# Altium schematic sheet main.SchDoc: Game Console
size A3; Author: Melanie Rojas; Engineer: Melanie Rojas; Organization: PUC; Address1: Santiago, Chile; Address2: -; Address3: -; Address4: -; DocumentNumber: 1000; Revision: 1; SheetNumber: 1; SheetTotal: 1
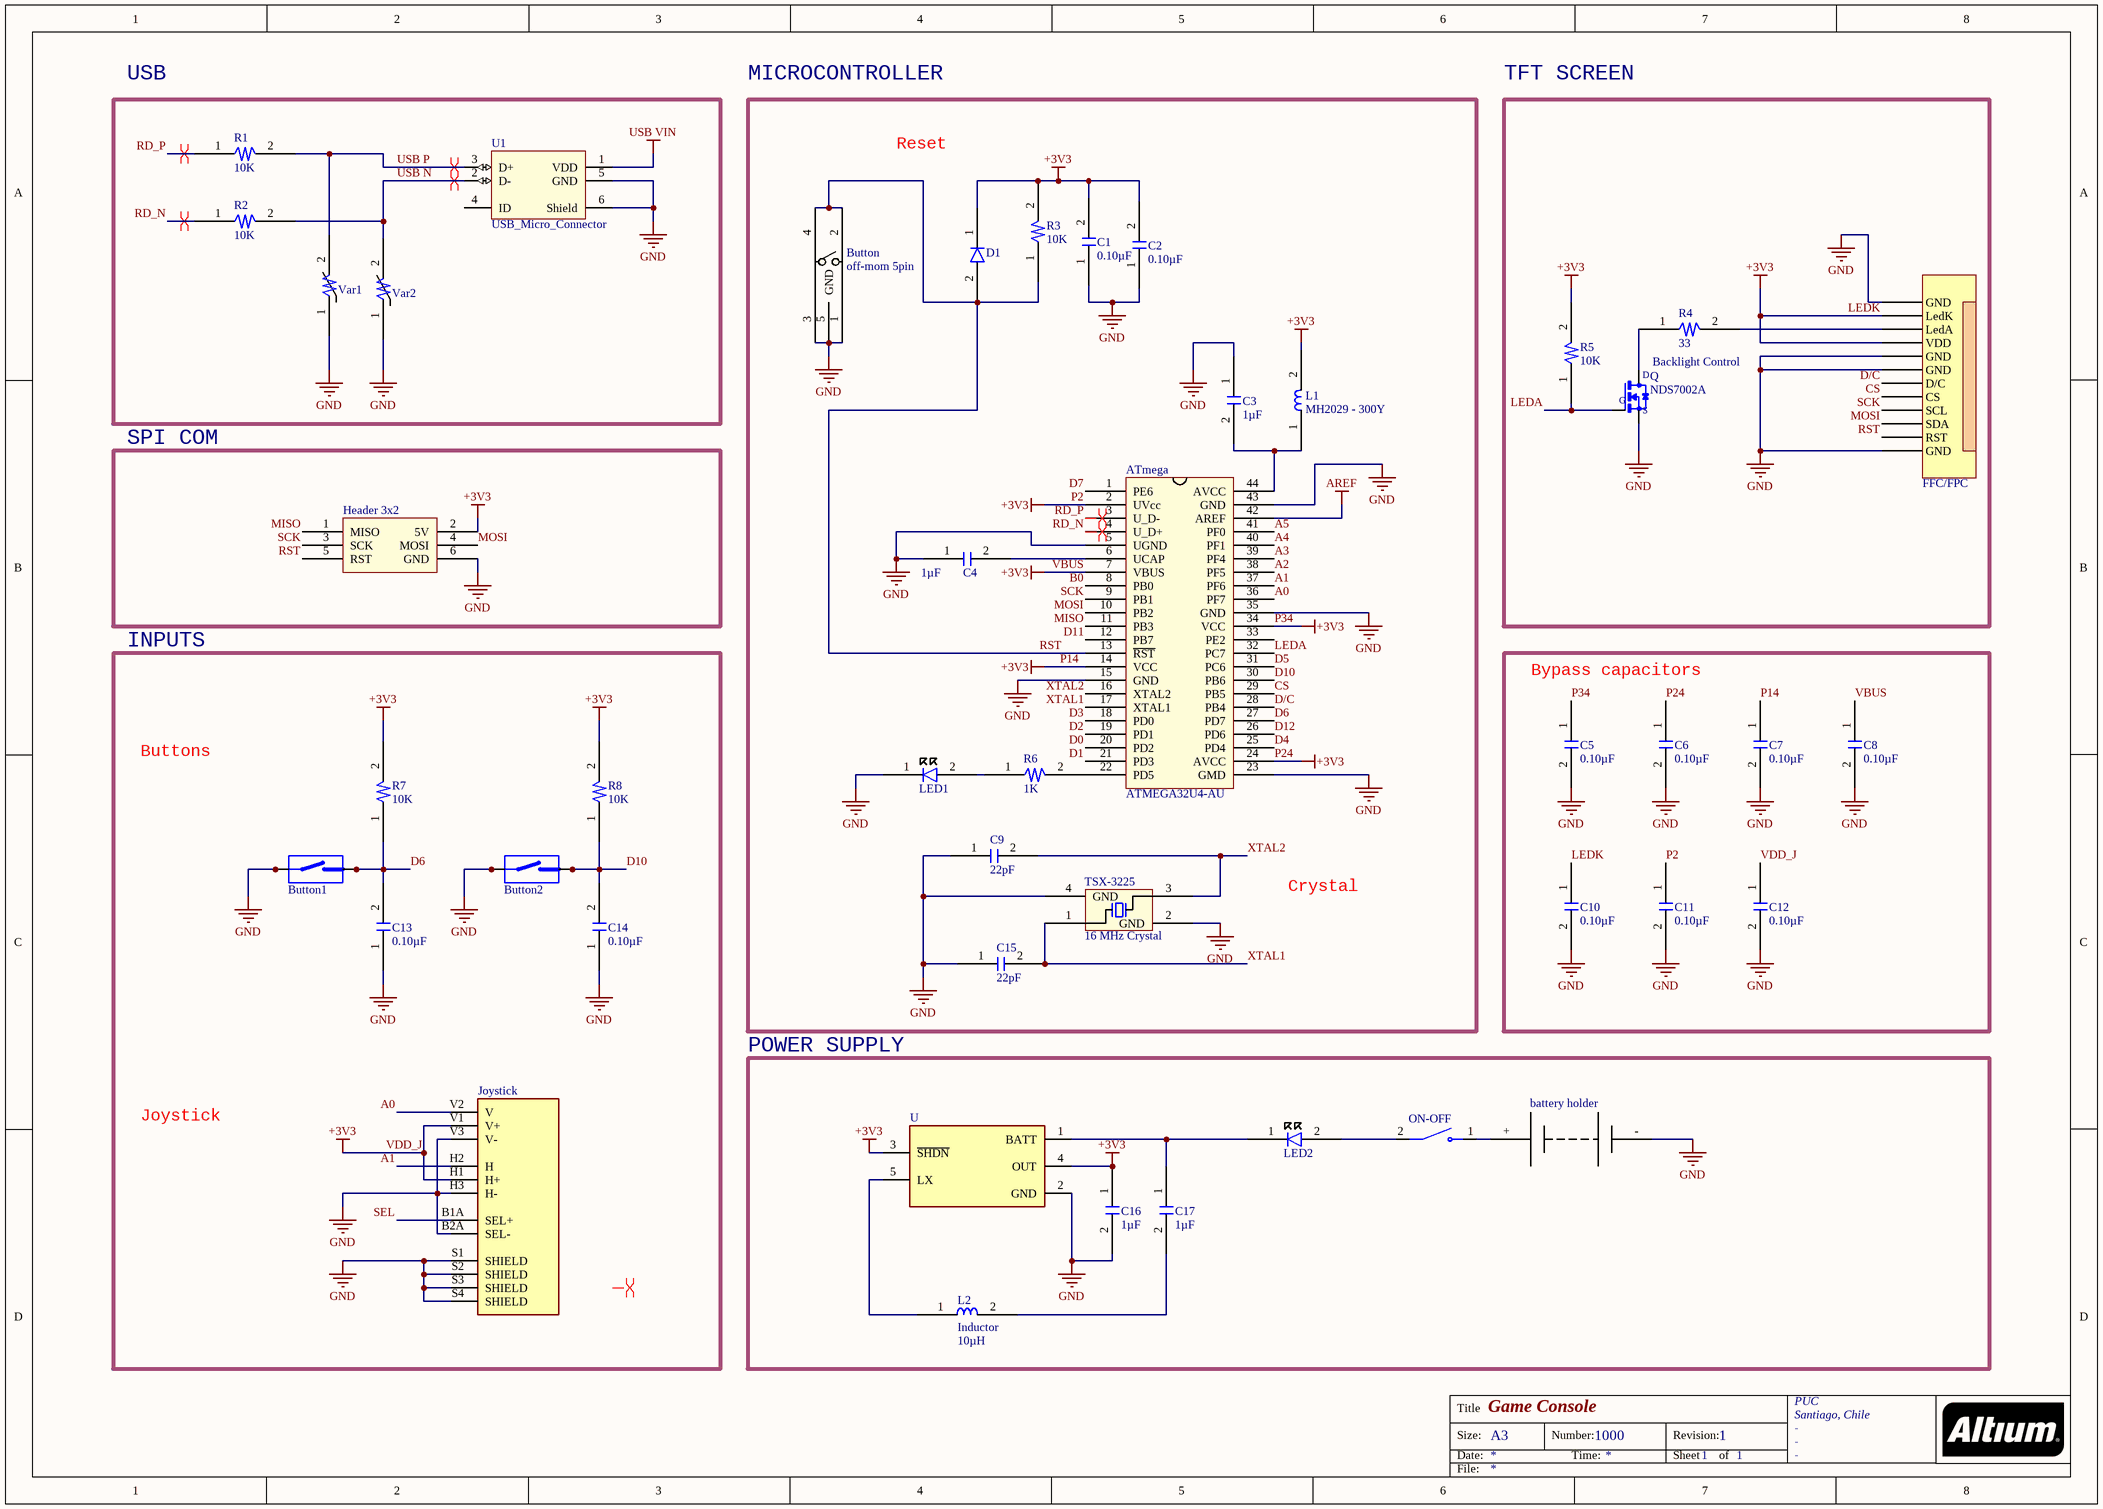
[diagram p0: main.SchDoc]

## Parts
ATmega  Supplier Part Number 1: ATMEGA32U4-AU  [ATmega32u4_TQFP44]  (hidden comment: ATmega32u4)
battery_holder  battery holder  (value not drawn)
Button  off-mom 5pin  [450-1760]
Button1  5-1437565-0  [SW_5-1437565-0]  (value not drawn)
Button2  5-1437565-0  [SW_5-1437565-0]  (value not drawn)
C1  value 0.10µF  [R15_0805_cap_M]  (hidden comment: 0.10µ 25V)
C2  value 0.10µF  [R15_0805_cap_M]  (hidden comment: 0.10µ 25V)
C3  value 1µF  [C2012_M]  (hidden comment: 1µF 50V cap)
C4  value 1µF  [C2012_M]  (hidden comment: 1µF 50V cap)
C5  value 0.10µF  [R15_0805_cap_M]  (hidden comment: 0.10µ 25V)
C6  value 0.10µF  [R15_0805_cap_M]  (hidden comment: 0.10µ 25V)
C7  value 0.10µF  [R15_0805_cap_M]  (hidden comment: 0.10µ 25V)
C8  value 0.10µF  [R15_0805_cap_M]  (hidden comment: 0.10µ 25V)
C9  value 22pF  [R15_0805_cap_M]  (hidden comment: 22pF 50V cap)
C10  value 0.10µF  [R15_0805_cap_M]  (hidden comment: 0.10µ 25V)
C11  value 0.10µF  [R15_0805_cap_M]  (hidden comment: 0.10µ 25V)
C12  value 0.10µF  [R15_0805_cap_M]  (hidden comment: 0.10µ 25V)
C13  value 0.10µF  [R15_0805_cap_M]  (hidden comment: 0.10µ 25V)
C14  value 0.10µF  [R15_0805_cap_M]  (hidden comment: 0.10µ 25V)
C15  value 22pF  [R15_0805_cap_M]  (hidden comment: 22pF 50V cap)
C16  value 1µF  [C2012_M]  (hidden comment: 1µF 50V cap)
C17  value 1µF  [C2012_M]  (hidden comment: 1µF 50V cap)
D1  100V Switching Diode  [C2012_M]  (value not drawn)
FFC/FPC  1-84952-2  (value not drawn)
Header_3x2  J3*2  [J3*2]  (value not drawn)
Joystick  COM-09032  [XDCR_COM-09032]  (value not drawn)
L1  MH2029 - 300Y  [MH2029-300YC]
L2  Inductor  value 10µH  [MH2029-300YC]
LED1  LED  [Wurth led 0805]  (value not drawn)
LED2  LED  [Wurth led 0805]  (value not drawn)
ON-OFF  RB141C1100  [SW_RB141C1100]  (value not drawn)
Q  NDS7002A  [SOT23]
R1  value 10K  [RNCP0805_M]  (hidden comment: Res)
R2  value 10K  [RNCP0805_M]  (hidden comment: Res)
R3  value 10K  [RNCP0805_M]  (hidden comment: Res)
R4  value 33  [RNCP0805_M]  (hidden comment: Res)
R5  value 10K  [RNCP0805_M]  (hidden comment: Res)
R6  value 1K  [RNCP0805_M]  (hidden comment: Res)
R7  value 10K  [RNCP0805_M]  (hidden comment: Res)
R8  value 10K  [RNCP0805_M]  (hidden comment: Res)
TSX-3225  16 MHz Crystal  [TSX-3225]
U  MAX1724EZK33+T  [SOT95P275X110-5N]  (value not drawn)
U1  USB_Micro_Connector  [USB_micro_through]
Var1  Gard Resistor  [UltraGuard 0805]  (value not drawn)
Var2  Gard Resistor  [UltraGuard 0805]  (value not drawn)

## Blocks framed on the sheet
USB: R1 R2 U1 Var1 Var2
MICROCONTROLLER: ATmega Button C1-C4 C9 C15 D1 L1 LED1 R3 R6 TSX-3225
TFT SCREEN: FFC/FPC Q R4 R5
SPI COM: Header_3x2
INPUTS: Button1 Button2 C13 C14 Joystick R7 R8
Bypass capacitors: C5-C8 C10-C12
POWER SUPPLY: battery_holder C16 C17 L2 LED2 ON-OFF U

## Nets
AREF: ATmega.42(AREF)
GND: ATmega.5(UGND) ATmega.15(GND) ATmega.23(GMD) ATmega.35(GND) ATmega.43(GND) Button.1 Button.3 Button.5(GND) Button1.3 Button1.4 Button2.3 Button2.4 C1.1 C2.1 C3.1 C4.1 C5.2 C6.2 C7.2 C8.2 C9.1 C10.2 C11.2 C12.2 C13.1 C14.1 C15.1 C16.2 FFC/FPC.1(GND) FFC/FPC.5(GND) FFC/FPC.6(GND) FFC/FPC.12(GND) Header_3x2.6(GND) Joystick.B2A(SEL-) Joystick.H3(H-) Joystick.S1(SHIELD) Joystick.S2(SHIELD) Joystick.S3(SHIELD) Joystick.S4(SHIELD) Joystick.V3(V-) LED1.1 Q.2(S) TSX-3225.2(GND) TSX-3225.4(GND) U.2(GND) U1.5(GND) U1.6(Shield) Var1.1 Var2.1
LEDK: ATmega.2(UVcc) ATmega.7(VBUS) ATmega.14(VCC) ATmega.24(AVCC) ATmega.34(VCC) C1.2 C2.2 C5.1 C6.1 C7.1 C8.1 C10.1 C11.1 C12.1 C16.1 D1.1 FFC/FPC.2(LedK) FFC/FPC.10(VDD) Header_3x2.2(5V) Joystick.H1(H+) Joystick.V1(V+) L1.2 R3.2 R5.2 R7.2 R8.2 U.3(~{SHDN}) U.4(OUT)  [also labelled +3V3, P14, P2, P24, P34, VBUS, VDD_J]
USB VIN: U1.1(VDD)
A0: ATmega.36(PF7) Joystick.V2(V)
A1: ATmega.37(PF6) Joystick.H2(H)
A2: ATmega.38(PF5)
A3: ATmega.39(PF4)
A4: ATmega.40(PF1)
A5: ATmega.41(PF0)
B0: ATmega.8(PB0)
CS: ATmega.29(PB5) FFC/FPC.8(CS)
D0: ATmega.20(PD2)
D1: ATmega.21(PD3)
D2: ATmega.19(PD1)
D3: ATmega.18(PD0)
D4: ATmega.25(PD4)
D5: ATmega.31(PC6)
D6: ATmega.27(PD7) Button1.1 Button1.2 C13.2 R7.1
D7: ATmega.1(PE6)
D10: ATmega.30(PB6) Button2.1 Button2.2 C14.2 R8.1
D11: ATmega.12(PB7)
D12: ATmega.26(PD6)
D/C: ATmega.28(PB4) FFC/FPC.7(D/C)
LEDA: ATmega.32(PC7) Q.1(G) R5.1
MISO: ATmega.11(PB3) Header_3x2.1(MISO)
MOSI: ATmega.10(PB2) FFC/FPC.10(SDA) Header_3x2.4(MOSI)
RD_N: ATmega.4(U_D+) R2.1
RD_P: ATmega.3(U_D-) R1.1
RST: ATmega.13(~{RST}) Button.2 Button.4 D1.2 FFC/FPC.11(RST) Header_3x2.5(RST) R3.1
SCK: ATmega.9(PB1) FFC/FPC.9(SCL) Header_3x2.3(SCK)
SEL: Joystick.B1A(SEL+)
USB N: R2.2 U1.2(D-) Var2.2
USB P: R1.2 U1.3(D+) Var1.2
XTAL1: ATmega.17(XTAL1) C15.2 TSX-3225.1
XTAL2: ATmega.16(XTAL2) C9.2 TSX-3225.3
NetATmega_6: ATmega.6(UCAP) C4.2
NetATmega_22: ATmega.22(PD5) R6.2
NetATmega_44: ATmega.44(AVCC) C3.2 L1.1
NetC17_1: C17.1 LED2.1 U.1(BATT)
NetC17_2: C17.2 L2.2
NetFFC/FPC_3: FFC/FPC.3(LedA) R4.2
NetL2_1: L2.1 U.5(LX)
NetLED1_2: LED1.2 R6.1
NetLED2_2: LED2.2 ON-OFF.2
NetQ_3: Q.3(D) R4.1

Not connected (* = marked no-connect by the designer): ATmega 33(PE2); battery_holder + -; ON-OFF 1; U1 4(ID)

## Layout directives
differential pair: (no net found under the mark), RD_N, RD_P, USB N, USB P

## Notes on the sheet
- Reset
- Backlight Control
- Buttons
- Crystal
- Joystick
- Title
- Size:
- Date:
- A3
- Number:
- Time:
- Revision:
- Sheet
- of
- File:

## Library data of the parts
battery_holder = BCAAPC: Supplier 1: Digi-Key; Type: Battery holder; Supplier Part Number 1: BCAAPC-ND
Button = Button: Supplier 1: Digi-Key; Supplier Part Number 1: 450-1760-1-ND; Type: Button
Button1 Button2 = 5-1437565-0: Switch Push Button N.O. SPST Round Button 0.05A 12VDC 1VA Alternate Contact Gull Wing SMD T/R; MP: FSM6JSMATR; MF: TE Connectivity; SnapEDA_Link: https://www.snapeda.com/parts/FSM6JSMATR/TE%20Connectivity%20ALCOSWITCH%20Switches/view-part/518064/?ref=snap; Price: None; TE_purchase_URL: https://www.te.com/usa-en/product-5-1437565-0.html?te_bu=Cor&te_type=disp&te_campaign=seda_glo_cor-seda-global-disp-prtnr-fy19-seda-model-bom-cta_sma-317_1&elqCampaignId=32493; Value: *; Availability: Unavailable; Package: None; Supplier 1: Digi-Key; Supplier Part Number 1: 450-2058-1-ND; Type: Button
C1 C2 C5-C8 C10-C14 = 0.10µF 25V Cap: Details: 0.10µF ±10% 25V Ceramic Capacitor X7R 0805 (2012 Metric); Type: Ceramic Capacitor; Footprint: 0805 (2012 Metric) -X7R; Supplier 1: Digi-Key; Supplier Part Number 1: 399-1168-1-ND
C3 C4 C16 C17 = 1µF 50V cap: Type: Capacitor (ceramic); Supplier 1: Digi-Key; Supplier Part Number 1: 445-8890-1-ND
C9 C15 = 22pF 50V cap: Type: Capacitor (ceramic); Supplier 1: Digi-Key; Supplier Part Number 1: 490-5868-1-ND
D1 = CD1206 - S01575: Standard Diode; Supplier 1: Digi-Key; Supplier 2: Arrow; Supplier Part Number 2: CD1206-S01575; Supplier Part Number 1: CD0603-S01575CT-ND
Header_3x2 = J3*2: Header 3*2; Supplier 1: Digi-Key; Supplier Part Number 1: 609-3234-ND
Joystick = COM-09032: Joystick, 2 - Axis Analog _Resistive_ Output; MF: SparkFun Electronics; SnapEDA_Link: https://www.snapeda.com/parts/COM-09032/SparkFun%20Electronics/view-part/888157/?ref=snap; Availability: Unavailable; Value: *; Price: None; MP: COM-09032; Package: SparkFun Electronics; Supplier 1: Digi-Key; Supplier Part Number 1: 1568-1526-ND
L1 = MH2029 - 300Y: Ferrite bead; Value: 30@10MHz; Supplier 1: Digi-Key; Supplier Part Number 1: MH2029-300YCT-ND; Type: Ferrite
LED1 LED2 = LED: LED 0805; Color: RED; Type: LED; Supplier 1: Digi-Key; Supplier Part Number 1: 732-4984-1-ND
ON-OFF = RB141C1100: Rocker Switch SPST 15A _AC_ 125V Panel Mount, Snap-In; MF: E-Switch; Package: None; Availability: Unavailable; SnapEDA_Link: https://www.snapeda.com/parts/RB141C1100/E-Switch/view-part/4449618/?ref=snap; MP: RB141C1100; Price: None; Value: *; Supplier 1: Digi-Key; Supplier Part Number 1: EG5637-ND
Q = NDS7002A: N-Channel 60V 280mA _Ta_ 300mW _Ta_ Surface Mount SOT-23 _TO-236AB_; MF: ON Semiconductor; MP: NDS7002A; Availability: Unavailable; SnapEDA_Link: https://www.snapeda.com/parts/NDS7002A/ON%20Semiconductor/view-part/2657545/?ref=snap; Package: SOT-23-3 ON Semiconductor; Price: None; Value: *; Supplier 1: Digi-Key; Supplier Part Number 1: NDS7002ACT-ND
R1 R2 = 10k Res_1: Resistor 0805; Supplier 1: Digi-Key; Supplier Part Number 1: CR0805-JW-103ELFDKR-ND; Type: Resistor
R3 R5 R7 R8 = 10k Res: Resistor 0805; Supplier 1: Digi-Key; Supplier Part Number 1: CR0805-JW-103ELFDKR-ND; Type: Resistor
R4 = 33 Res_1: Resistor 0805; Type: Resistor; Supplier 1: Digi-Key; Supplier Part Number 1: 118-CR0805-FX-33R0ELFCT-ND
R6 = 1k Res: Resistor 0805; Type: Resistor; Supplier 1: Digi-Key; Supplier Part Number 1: A129749CT-ND
U = MAX1724EZK33+T: Boost Switching Regulator IC Positive Fixed 3.3V 1 Output 400mA _Switch_ SOT-23-5 Thin, TSOT-23-5; MF: Maxim Integrated; Value: *; SnapEDA_Link: https://www.snapeda.com/parts/MAX1724EZK33%2BT/Maxim%20Integrated/view-part/571456/?ref=snap; Package: SOT-23-5 Maxim; MP: MAX1724EZK33+T; Availability: Unavailable; Price: None; Type: Regulator; Supplier 1: Digi-Key; Supplier Part Number 1: MAX1724EZK33+TCT-ND
U1 = USB_micro_through: CONN USB MICRO B RECPT SMT R/A; Manufacturer Part Number: 10118194-0001LF; 01 Created By: David Lynch @ 30/11/2017; 02 Reviewed By: Rodrigo Maureira @ 14/01/2018; Supplier Part Number 1: 609-4618-1-ND; Digikey URL: https://www.digikey.com.au/product-detail/en/amphenol-fci/10118194-0001LF/609-4618-1-ND/2785382; Supplier 1: Digi-Key
ATmega = ATmega32U4: Supplier 1: Avnet
FFC/FPC = 1-84952-2: Supplier 1: Digi-Key; Category: FFC/FPC CONNECTOR; Supplier Part Number 1: A100251CT-ND
L2 = Inductor: Type: Inductor; Supplier 1: Digi-Key; Supplier Part Number 1: 732-10757-1-ND
TSX-3225 = 16 MHz Crystal: Supplier 1: Digi-Key; Supplier Part Number 1: SER3636TR-ND
Var1 Var2 = Gard Resistor: Supplier 1: Digi-Key; Supplier Part Number 1: 478-2504-1-ND; Type: Varistor